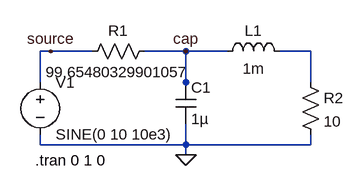
[diagram p0: schematic cselfmade.asc]
cselfmade.asc, the LTspice schematic file:
Version 4
SHEET 1 880 680
WIRE 80 64 64 64
WIRE 144 64 80 64
WIRE 288 64 224 64
WIRE 352 64 288 64
WIRE 480 64 432 64
WIRE 64 112 64 64
WIRE 288 112 288 64
WIRE 480 112 480 64
WIRE 288 128 288 112
WIRE 64 208 64 192
WIRE 288 208 288 176
WIRE 288 208 64 208
WIRE 480 208 480 192
WIRE 480 208 288 208
WIRE 288 224 288 208
FLAG 288 224 0
FLAG 80 64 source
FLAG 288 64 cap
SYMBOL voltage 64 96 R0
WINDOW 123 0 0 Left 0
WINDOW 39 0 0 Left 0
SYMATTR InstName V1
SYMATTR Value SINE(0 10 10e3)
SYMBOL res 240 48 R90
WINDOW 0 0 56 VBottom 2
WINDOW 3 32 56 VTop 2
SYMATTR InstName R1
SYMATTR Value 99.65480329901057
SYMBOL cap 272 112 R0
SYMATTR InstName C1
SYMATTR Value 1µ
SYMBOL ind 448 80 M270
WINDOW 0 32 56 VTop 2
WINDOW 3 5 56 VBottom 2
SYMATTR InstName L1
SYMATTR Value 1m
SYMBOL res 464 96 R0
SYMATTR InstName R2
SYMATTR Value 10
TEXT 56 232 Left 2 !.tran 0 1 0

The netlist it stands for:
* cselfmade.asc
V1 source 0 SINE(0 10 10e3)
R1 cap source 99.65480329901057
C1 cap 0 1µ
L1 N001 cap 1m
R2 N001 0 10
.tran 0 1 0
.backanno
.end